# EAGLE design power (EAGLE 6.4)
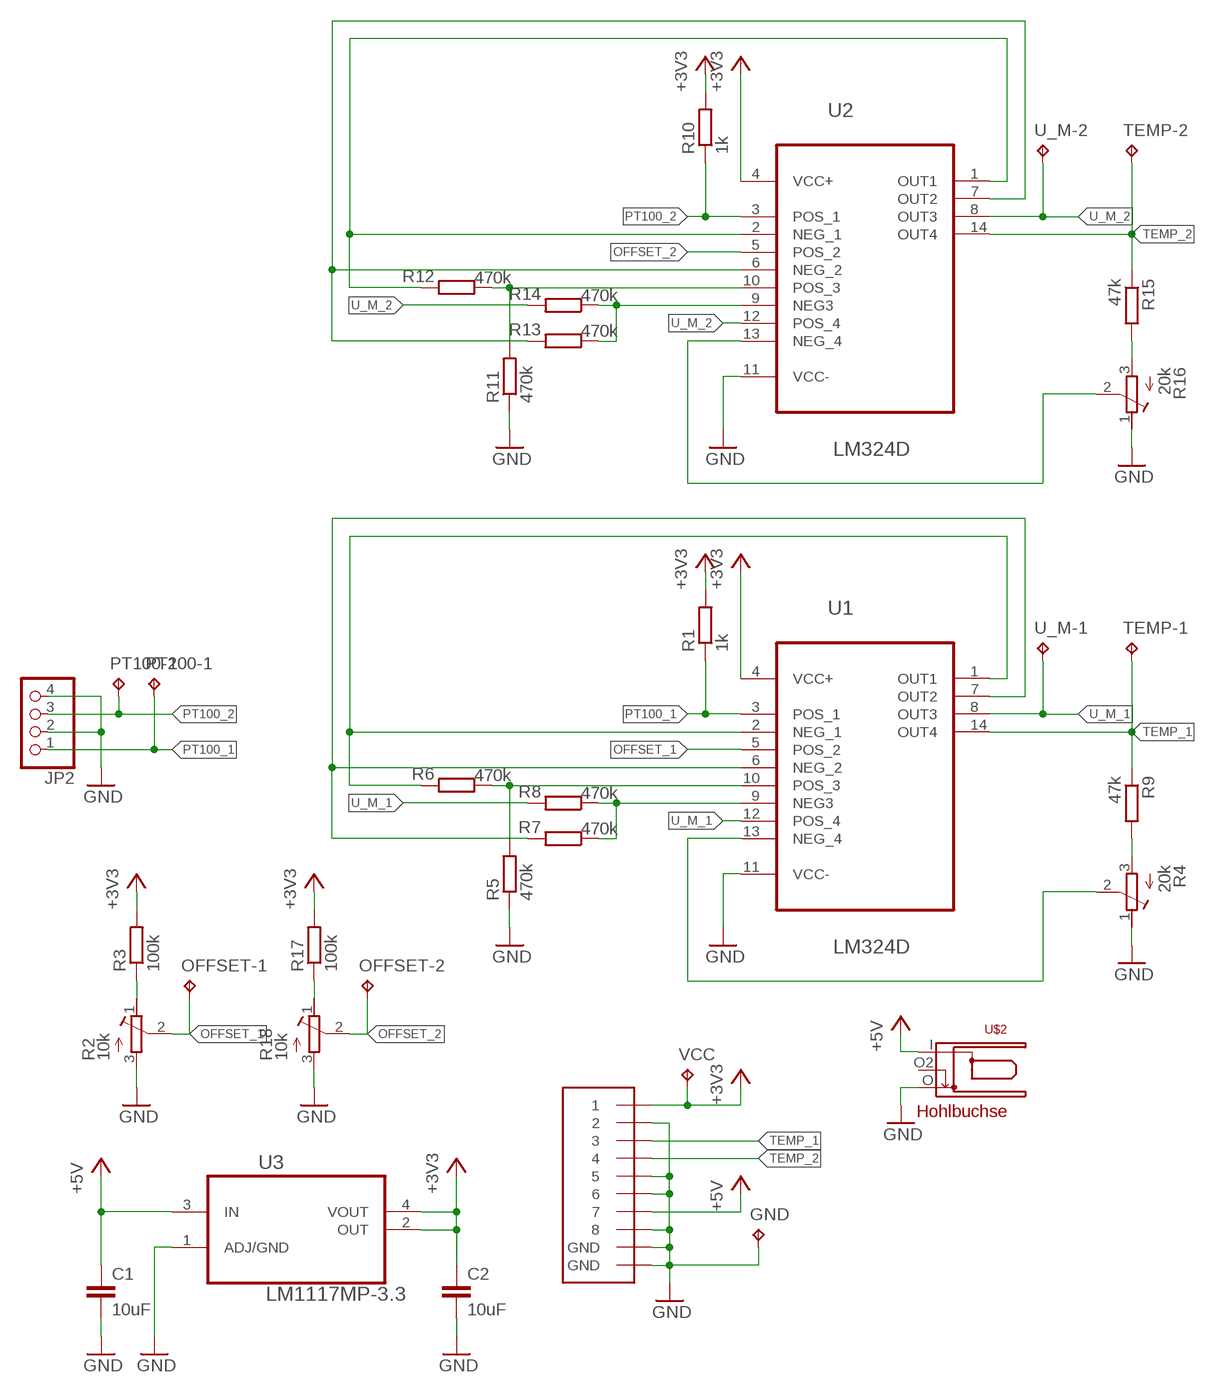
[diagram p0: schematic, sheet 1]

## Parts
C1  10uF  C-EUC0805  [C0805]
C2  10uF  C-EUC0805  [C0805]
GND  TPB1,27  [B1,27]
JP2  PINHD-1X4/90  [1X04/90]
OFFSET-1  TPB1,27  [B1,27]
OFFSET-2  TPB1,27  [B1,27]
PT100-1  TPB1,27  [B1,27]
PT100-2  TPB1,27  [B1,27]
R1  1k  R-EU_R0805  [R0805]
R2  10k  R-TRIMMT93YB  [RTRIMT93YB]
R3  100k  R-EU_R0805  [R0805]
R4  20k  R-TRIMMT93YB  [RTRIMT93YB]
R5  470k  R-EU_R0805  [R0805]
R6  470k  R-EU_R0805  [R0805]
R7  470k  R-EU_R0805  [R0805]
R8  470k  R-EU_R0805  [R0805]
R9  47k  R-EU_R0805  [R0805]
R10  1k  R-EU_R0805  [R0805]
R11  470k  R-EU_R0805  [R0805]
R12  470k  R-EU_R0805  [R0805]
R13  470k  R-EU_R0805  [R0805]
R14  470k  R-EU_R0805  [R0805]
R15  47k  R-EU_R0805  [R0805]
R16  20k  R-TRIMMT93YB  [RTRIMT93YB]
R17  100k  R-EU_R0805  [R0805]
R18  10k  R-TRIMMT93YB  [RTRIMT93YB]
TEMP-1  TPB1,27  [B1,27]
TEMP-2  TPB1,27  [B1,27]
U1  LM324D  [SOIC127P600X175-14N]
U2  LM324D  [SOIC127P600X175-14N]
U3  LM1117MP-3.3  [SOT230P696X180-4N]
U$1  MEBP8-8G  [RJ45-REICHELT]
U$2  HOHLBUCHSE  [HOHLBUCHSE]
U_M-1  TPB1,27  [B1,27]
U_M-2  TPB1,27  [B1,27]
VCC  TPB1,27  [B1,27]

## Nets
+3V3: C2.1 R1.2 R3.2 R10.2 R17.2 U1.4(VCC+) U2.4(VCC+) U3.2(OUT) U3.4(VOUT) U$1.1 VCC.TP
+5V: C1.1 U3.3(IN) U$1.7 U$2.I
GND: C1.2 C2.2 GND.TP JP2.2 JP2.4 R2.3(A) R4.1(E) R5.1 R11.1 R16.1(E) R18.3(A) U1.11(VCC-) U2.11(VCC-) U3.1(ADJ/GND) U$1.2 U$1.5 U$1.6 U$1.8 U$1.GND@1(GND) U$1.GND@2(GND) U$2.O
N$1: R4.2(S) U1.13(NEG_4)
N$2: R5.2 R6.1 U1.10(POS_3)
N$3: R2.1(E) R3.1
N$4: R15.2 R16.3(A)
N$5: R6.2 U1.1(OUT1) U1.2(NEG_1)
N$6: R16.2(S) U2.13(NEG_4)
N$7: R7.2 U1.6(NEG_2) U1.7(OUT2)
N$8: R7.1 R8.1 U1.9(NEG3)
N$9: R11.2 R12.1 U2.10(POS_3)
N$10: R12.2 U2.1(OUT1) U2.2(NEG_1)
N$11: R4.3(A) R9.2
N$12: R13.2 U2.6(NEG_2) U2.7(OUT2)
N$13: R13.1 R14.1 U2.9(NEG3)
N$14: R17.1 R18.1(E)
OFFSET_1: OFFSET-1.TP R2.2(S) U1.5(POS_2)
OFFSET_2: OFFSET-2.TP R18.2(S) U2.5(POS_2)
PT100_1: JP2.1 PT100-1.TP R1.1 U1.3(POS_1)
PT100_2: JP2.3 PT100-2.TP R10.1 U2.3(POS_1)
TEMP_1: R9.1 TEMP-1.TP U1.14(OUT4) U$1.3
TEMP_2: R15.1 TEMP-2.TP U2.14(OUT4) U$1.4
U_M_1: R8.2 U1.8(OUT3) U1.12(POS_4) U_M-1.TP
U_M_2: R14.2 U2.8(OUT3) U2.12(POS_4) U_M-2.TP
Unconnected: U$2.O2

## Library data of the parts
C1 C2 = rcl:C-EU: CAPACITOR, European symbol
GND OFFSET-1 OFFSET-2 PT100-1 PT100-2 TEMP-1 TEMP-2 U_M-1 U_M-2 VCC = testpad:TP: Test pad
JP2 = pinhead:PINHD-1X4: PIN HEADER
R1 R3 R5-R15 R17 = rcl:R-EU_: RESISTOR, European symbol
R2 R4 R16 R18 = rcl:R-TRIMM: Trimm resistor
U1 U2 = hexasense:LM324D: Low power quad operational amplifiers; MPN: LM324D; OC_FARNELL: 1467655; OC_NEWARK: 72K8847; PACKAGE: SOIC-14; SUPPLIER: STMicroelectronics
U3 = hexasense:LM1117MP-3.3: Linear regulators; MPN: LM1117MP-3.3; OC_FARNELL: 9778195; OC_NEWARK: 41K3470; PACKAGE: SOT223-3; SUPPLIER: NationalSemiconductor
U$1 = Reichelt:MEBP8-8G
U$2 = Ergaenzung:HOHLBUCHSE

## Board
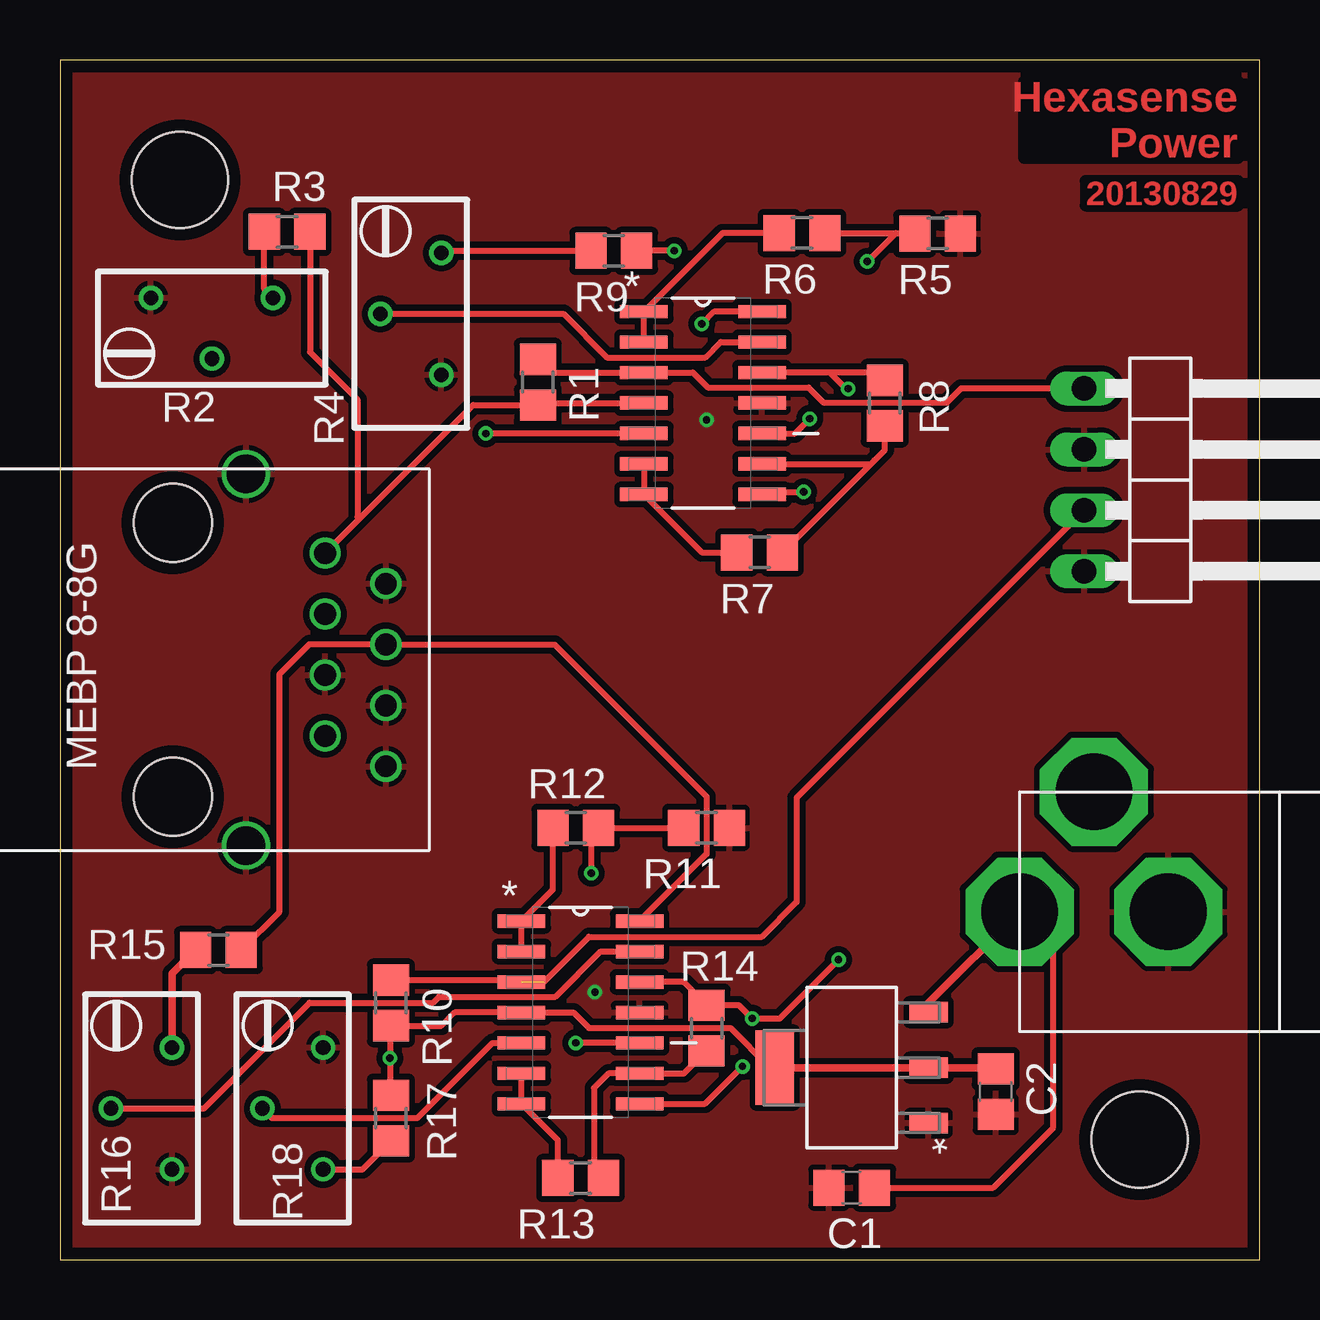
[diagram p1: board, top side]
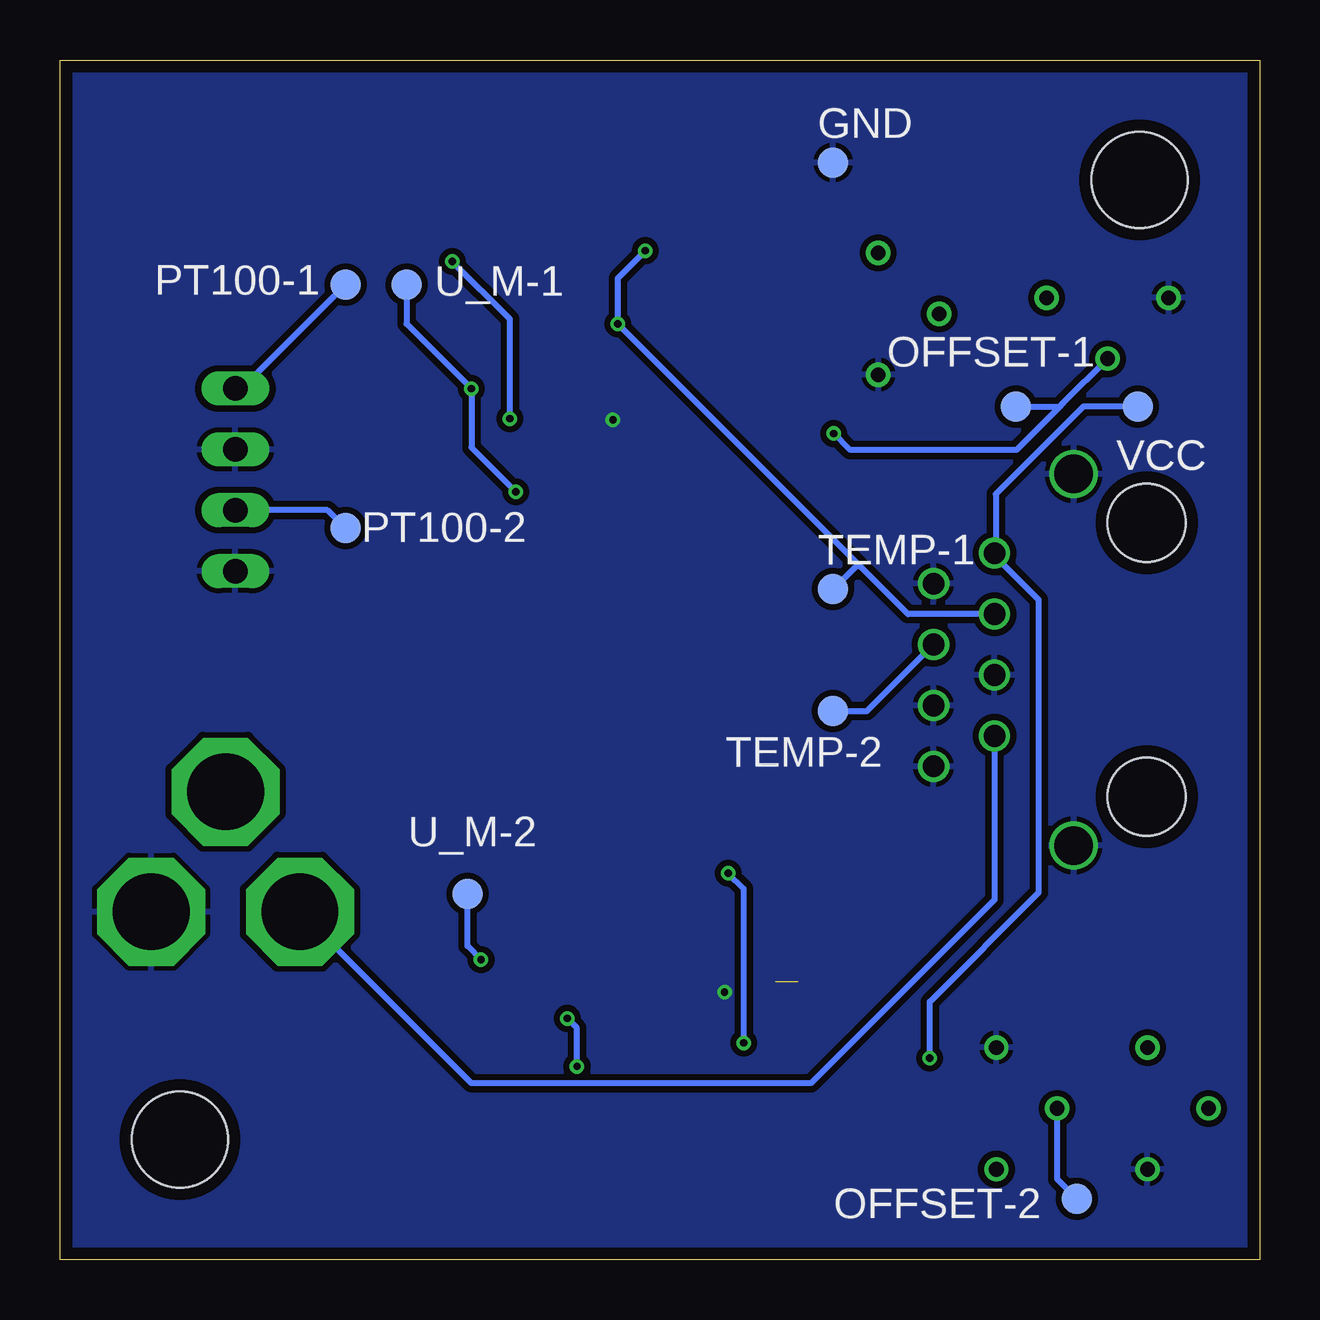
[diagram p2: board, bottom side, seen from below]

Size 50 x 50 mm. Coordinates in mm from the lower left corner, seen from the top.
Outline: 0,0 50,0 50,50 0,50 0,0
Copper layers (1*16): Top 0.035mm / dielectric 1.5mm / Bottom 0.035mm
Design rules "leiton": minimum track width 6mil, minimum drill 0.3mm, track to track 6mil, track to pad 6mil, pad to pad 6mil, via to via 6mil, smd to smd 6mil, copper to edge 20mil, drill to drill 8mil, minimum pad ring 8mil, minimum via ring 6mil, stop-mask expansion 3mil, vias tented up to drill 0mil, thermal gap 8mil
Holes 4 mm at 5,45 45,5

### Footprints (pad centres in the part's own frame; a part is rotated, then mirrored left to right if it is on the bottom)
C0805 = smd 1.3 x 1.5: 1 -0.95,0; 2 0.95,0
B1,27 = smd 1.27 x 1.27: TP 0,0
1X04/90 = drill 1.016 long: 1 -3.81,-3.81; 2 -1.27,-3.81; 3 1.27,-3.81; 4 3.81,-3.81
R0805 = smd 1.3 x 1.5: 1 -0.95,0; 2 0.95,0
RTRIMT93YB = drill 0.61: 1 1.27,-2.54; 2 -1.27,0; 3 1.27,2.54
SOIC127P600X175-14N = smd 1.981 x 0.559: 1 -2.464,3.81; 2 -2.464,2.54; 3 -2.464,1.27; 4 -2.464,0; 5 -2.464,-1.27; 6 -2.464,-2.54; 7 -2.464,-3.81; 8 2.464,-3.81; 9 2.464,-2.54; 10 2.464,-1.27; 11 2.464,0; 12 2.464,1.27; 13 2.464,2.54; 14 2.464,3.81
SOT230P696X180-4N = smd 1.6 x 0.838: 1 -3.2,2.311; 2 -3.2,0; 3 -3.2,-2.311 | smd 1.6 x 3.099: 4 3.2,0
RJ45-REICHELT = drill 0.9: 1 -4.445,6.35; 2 -3.175,8.89; 3 -1.905,6.35; 4 -0.635,8.89; 5 0.635,6.35; 6 1.905,8.89; 7 3.175,6.35; 8 4.445,8.89 | drill 1.6: GND@1 -7.745,3.05; GND@2 7.745,3.05 | hole 3.25: -5.715,0; 5.715,0
HOHLBUCHSE = drill 3.2 pad 4.5 octagon: I 0,0; O 6.2,0; O2 3.1,5

### Placement (x,y rotation side)
C1  33,3 180 top
C2  39,7 270 top
GND  17.78,45.72 0 bottom
JP2  46.5,32.5 270 top
OFFSET-1  10.16,35.56 0 bottom
OFFSET-2  7.62,2.54 0 bottom
PT100-1  38.1,40.64 0 bottom
PT100-2  38.1,30.48 0 bottom
R1  19.92,36.57 270 top
R2  6.33,38.82 90 top
R3  9.47,42.84 0 top
R4  14.62,39.42 0 top
R5  36.58,42.77 180 top
R6  30.93,42.79 180 top
R7  29.16,29.47 180 top
R8  34.38,35.7 90 top
R9  23.08,42.05 180 top
R10  13.8,10.7 270 top
R11  26.95,18 180 top
R12  21.5,18 180 top
R13  21.7,3.4 180 top
R14  26.95,9.65 90 top
R15  6.6,12.9 180 top
R16  3.4,6.3 0 top
R17  13.8,5.9 90 top
R18  9.7,6.3 0 top
TEMP-1  17.78,27.94 0 bottom
TEMP-2  17.78,22.86 0 bottom
U1  26.8,35.7 0 top
U2  21.7,10.3 0 top
U3  33,8 180 top
U$1  4.7,25 270 top
U$2  40,14.5 0 top
U_M-1  35.56,40.64 0 bottom
U_M-2  33.02,15.24 0 bottom
VCC  5.08,35.56 270 bottom

### Tracks (layer width: path | path; a pad name or v marks a point on that pad's centre or on a via)
+3V3  (via drill 0.3)
  Top 0.254: U1.4 20,35.7 R1.2 17.23,35.62 12.48,30.87 | U$1.1 12.48,30.87 | R17.2 13.75,6.9 v13.75,8.4 13.75,9.6 R10.2 15.9,9.75 16.45,10.3 U2.4 21.4,10.3 22.05,9.65 27.95,9.65 29.6,8 U3.4 | R3.2 10.42,37.83 12.4,35.85 12.4,30.95 12.48,30.87
  Top 0.305: U3.4 U3.2 38.95,8 C2.1
  Bottom 0.254: v13.75,8.4 13.75,10.75 9.2,15.3 9.2,27.5 11.05,29.35 U$1.1 11,29.5 11,31.9 7.34,35.56 VCC.TP
+5V
  Top 0.254: C1.1 38.9,3 41.4,5.5 41.4,13.1 U$2.I
  Top 0.305: U3.3 36.2,10.7 U$2.I
  Bottom 0.254: U$1.7 11.05,15 18.7,7.35 32.85,7.35 U$2.I
GND  (via drill 0.3)
  other vias: 22.3,11.15 26.95,35
  pour Bottom (isolate 0.254): 0,0 50,0 50,50 0,50
  pour Top (isolate 0.254): 0,0 50,0 50,50 0,50
N$1
  Top 0.254: R4.2 20.98,39.42 22.8,37.6 26.9,37.6 27.54,38.24 U1.13
N$2  (via drill 0.3)
  Top 0.254: R6.1 34.84,42.79 | R5.2 35.61,42.79 35.1,42.79 34.84,42.79 | U1.10 30.63,34.43 v31.25,35.05 | v33.65,41.6 34.84,42.79
  Bottom 0.254: v31.25,35.05 31.25,39.2 v33.65,41.6
N$3
  Top 0.254: R2.1 8.52,40.44 R3.1
N$4
  Top 0.305: R16.3 4.67,11.92 R15.2
N$5
  Top 0.254: U1.2 U1.1 27.62,42.79 R6.2
N$6
  Top 0.254: R16.2 6,6.3 10.4,10.7 15.55,10.7 15.8,10.95 20.65,10.95 22.54,12.84 U2.13 24.12,12.8
N$7
  Top 0.254: U1.6 U1.7 26.76,29.47 R7.2
N$8
  Top 0.254: R7.1 33.8,33.16 | R8.1 34.38,33.74 33.95,33.3 33.8,33.16 | U1.9 33.8,33.16
N$9  (via drill 0.3)
  Top 0.254: U2.10 v21.5,9.03 | v22.15,16.1 22.15,17.7 R12.1 R11.2
  Bottom 0.254: v21.5,9.03 21.5,15.45 v22.15,16.1
N$10
  Top 0.254: U2.2 U2.1 20.55,15.42 R12.2
N$11
  Top 0.254: R4.3 15.98,42.05 R9.2
N$12
  Top 0.254: R13.2 20.75,4.98 U2.7 U2.6
N$13
  Top 0.254: R13.1 22.25,3.8 22.25,7.15 22.86,7.76 U2.9 26.01,7.76 R14.1
N$14
  Top 0.254: R18.1 12.61,3.76 R17.1
OFFSET_1  (via drill 0.3)
  Top 0.254: U1.5 v17.75,34.43
  Bottom 0.254: 8.32,35.56 10.13,33.75 17.07,33.75 v17.75,34.43 | R2.2 8.19,35.69 8.32,35.56 | OFFSET-1.TP 8.32,35.56
OFFSET_2
  Top 0.254: R18.2 8.83,5.9 14.9,5.9 18.03,9.03 U2.5
  Bottom 0.254: OFFSET-2.TP 8.43,3.35 R18.2
PT100_1
  Top 0.254: R1.1 20.47,36.97 U1.3 26.38,36.97 27,36.35 31.2,36.35 31.85,35.7 36.95,35.7 37.56,36.31 JP2.1
  Bottom 0.254: PT100-1.TP 42.43,36.31 JP2.1
PT100_2  (1 unrouted)
  Top 0.254: R10.1 19.16,11.65 U2.3 | JP2.3 30.7,19.24 30.7,14.9 29.25,13.45 22.05,13.45 20.17,11.57
  Bottom 0.254: 42.31,30.85 JP2.3 38.85,31.23 PT100-2.TP
TEMP_1  (via drill 0.3)
  Top 0.254: U1.14 27.26,39.51 v26.75,39 | v25.6,42.05 R9.1
  Bottom 0.254: 25.6,42.14 v25.6,42.05 26.75,40.9 v26.75,39 16.65,28.9 | TEMP-1.TP 17.76,27.94 16.8,28.9 16.65,28.9 | U$1.3 14.65,26.91 16.65,28.9
TEMP_2
  Top 0.254: R15.1 9.15,14.5 9.15,24.4 10.4,25.65 13.57,25.65 U$1.4 20.61,25.64 26.95,19.3 26.95,16.9 U2.14
  Bottom 0.254: TEMP-2.TP 16.36,22.86 U$1.4
U_M_1  (via drill 0.3)
  Top 0.254: R8.2 34.06,36.97 32.1,36.97 | 32.1,36.97 U1.12 | U1.8 29.37,32 v31,32 | v32.85,36.3 32.77,36.3 32.1,36.97
  Bottom 0.254: v31,32 32.85,33.85 v32.85,36.3 35.56,39.01 U_M-1.TP
U_M_2  (via drill 0.3)
  Top 0.254: U2.12 25.98,11.57 R14.2 28.3,10.6 v28.85,10.05 30,10.05 v32.45,12.5 | U2.8 26.89,6.49 v28.45,8.05
  Bottom 0.254: v28.45,8.05 28.45,9.65 v28.85,10.05 | v32.45,12.5 33.02,13.07 U_M-2.TP

### Text on the board
Top: Hexasense / Power | 20130829